# Altium schematic sheet Sheet_1_2021-06-29.schdoc
size 249 x 187 mm
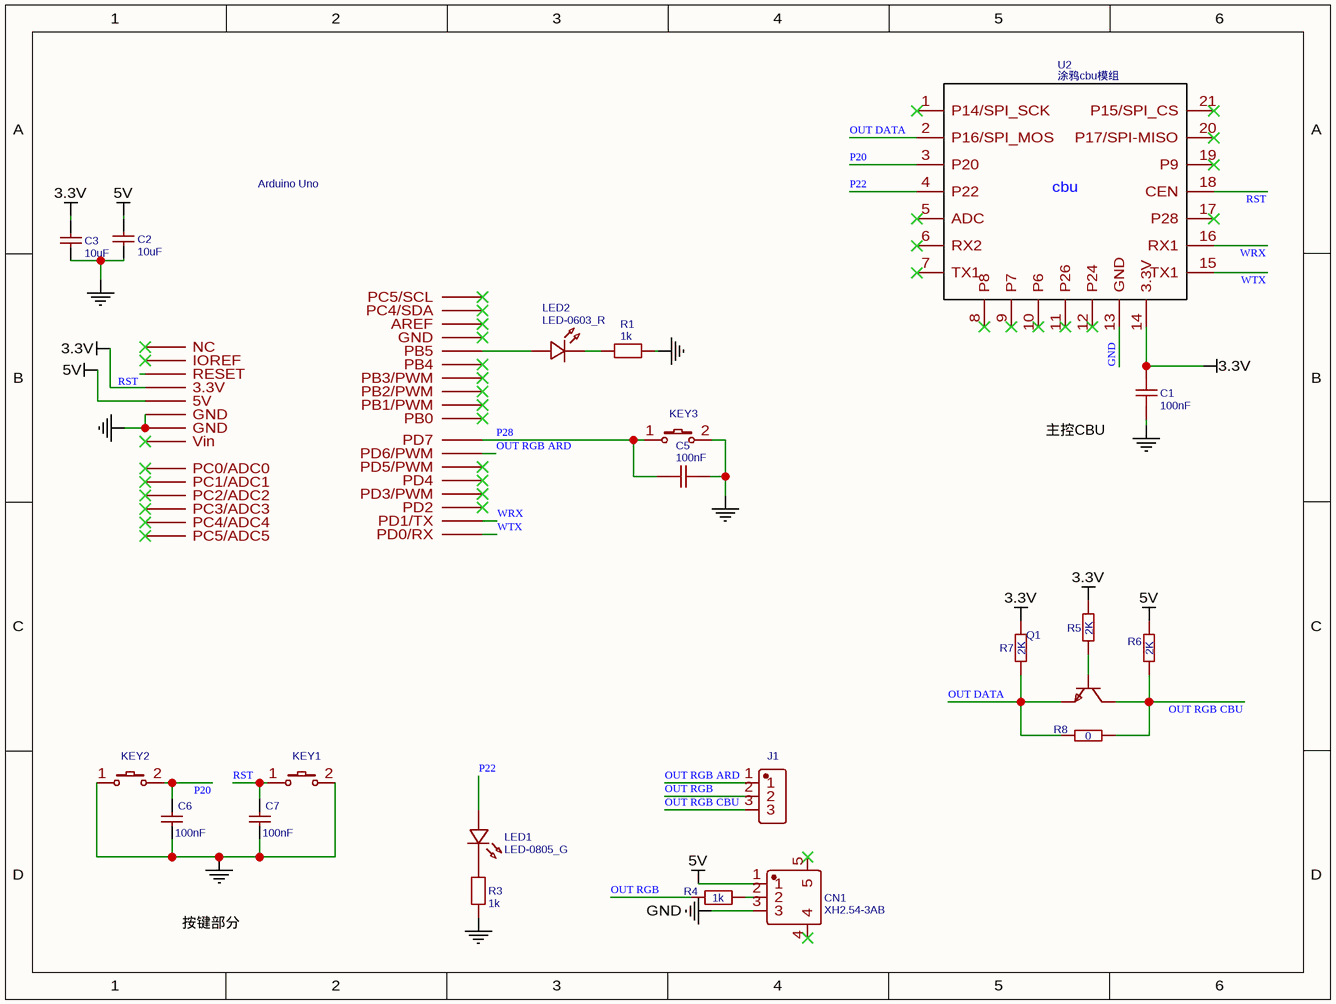
[diagram p0: Sheet_1_2021-06-29.schdoc]

## Parts
A1  Arduino Uno  [ARDUINO UNO_P2]
C1  100nF  [C0805]
C2  10uF  [C0805]
C3  10uF  [C0805]
C5  100nF  [C0805]
C6  100nF  [C0805]
C7  100nF  [C0805]
CN1  XH2.54-3AB  [CONN-SMD_3P-P2.54_XH2.54-3AB]
J1  A2541WV-3P  [HDR-TH_3P-P2.54-V-M]  (value not drawn)
KEY1  K2-3.6×6.1_SMD  [KEY-SMD_2P-L6.2-W3.6-LS8.0]  (value not drawn)
KEY2  K2-3.6×6.1_SMD  [KEY-SMD_2P-L6.2-W3.6-LS8.0]  (value not drawn)
KEY3  K2-3.6×6.1_SMD  [KEY-SMD_2P-L6.2-W3.6-LS8.0]  (value not drawn)
LED1  LED-0805_G  [LED0805_GREEN]
LED2  LED-0603_R  [LED0603_RED]
Q1  S8050_C908252  [SOT-23-3_L2.9-W1.3-P1.90-LS2.4-BR]  (value not drawn)
R1  1k  [R0805]
R3  1k  [R0805]
R4  1k  [R0805]
R5  2K  [R0805]
R6  2K  [R0805]
R7  2K  [R0805]
R8  0  [R0805]
U2  涂鸦cbu模组  [WIFI_BLE_CBU]

## Nets
3.3V: A1.4(3.3V) C1.1 C3.1 R5.2 R7.2 U2.14(3.3V)
5V: A1.5(5V) C2.1 CN1.1 R6.2
GND: A1.6(GND) A1.7(GND) C1.2 C2.2 C3.2 C5.1 C6.1 C7.1 CN1.3 KEY1.2 KEY2.1 KEY3.2 R1.2 R3.2 U2.13(GND)
OUT DATA: Q1.2(E) R7.1 R8.1 U2.2(P16/SPI_MOS)
OUT RGB: J1.2 R4.1
OUT RGB ARD: A1.21(PD6/PWM) J1.1
OUT RGB CBU: J1.3 Q1.3(C) R6.1 R8.2
P20: C6.2 KEY2.2 U2.3(P20)
P22: LED1.1 U2.4(P22)
P28: A1.22(PD7) C5.2 KEY3.1
RST: A1.3(RESET) C7.2 KEY1.1 U2.18(CEN)
WRX: A1.16(PD1/TX) U2.16(RX1)
WTX: A1.15(PD0/RX) U2.15(TX1)
NetA1_28: A1.28(PB5) LED2.1
NetCN1_2: CN1.2 R4.2
NetLED1_2: LED1.2 R3.1
NetLED2_2: LED2.2 R1.1
NetQ1_1: Q1.1(B) R5.1

Not connected (* = marked no-connect by the designer): A1 1(NC)* 2(IOREF)* 8(Vin)* 9(PC0/ADC0)* 10(PC1/ADC1)* 11(PC2/ADC2)* 12(PC3/ADC3)* 13(PC4/ADC4)* 14(PC5/ADC5)* 17(PD2)* 18(PD3/PWM)* 19(PD4)* 20(PD5/PWM)* 23(PB0)* 24(PB1/PWM)* 25(PB2/PWM)* 26(PB3/PWM)* 27(PB4)* 29(GND)* 30(AREF)* 31(PC4/SDA)* 32(PC5/SCL)*; CN1 4* 5*; U2 1(P14/SPI_SCK)* 5(ADC)* 6(RX2)* 7(TX1)* 8(P8)* 9(P7)* 10(P6)* 11(P26)* 12(P24)* 17(P28)* 19(P9)* 20(P17/SPI-MISO)* 21(P15/SPI_CS)*

## Notes on the sheet
- 主控CBU
- 按键部分
- (in symbol 涂鸦cbu模组) cbu

## Library data of the parts
A1 = Arduino Uno: Contributor: keleeda; BOM_Manufacturer Part: Arduino Uno; spicePre: A; spiceSymbolName: Arduino Uno
C1 C5 = 100nF: BOM_Manufacturer: MuRata; BOM_Manufacturer Part: GRM21BR61C106KE15L; nameAlias: Capacitance; BOM_Supplier: LCSC; BOM_Supplier Part: C77075; spicePre: C; spiceSymbolName: GRM21BR61C106KE15L
C2 C3 = 10uF: BOM_Manufacturer Part: CC0805KRX7R9BB104; BOM_Manufacturer: YAGEO; nameAlias: Capacitance; SMT Type: Basic; BOM_Supplier: LCSC; BOM_LCSC Assembly: Yes; BOM_Supplier Part: C49678; spicePre: C; spiceSymbolName: CC0805KRX7R9BB104
C6 C7 = 100nF: BOM_Manufacturer Part: CC0805KRX7R9BB104; BOM_Manufacturer: YAGEO; nameAlias: Capacitance; SMT Type: Basic; BOM_Supplier: LCSC; BOM_LCSC Assembly: Yes; BOM_Supplier Part: C49678; spicePre: C; spiceSymbolName: CC0805KRX7R9BB104
CN1 = XH2.54-3AB: BOM_Manufacturer: Boom Precision Elec; Contributor: LCSC; BOM_Supplier: LCSC; BOM_Supplier Part: C146126; BOM_Manufacturer Part: -; BOM_JLCPCB Part Class: Extended Part; spicePre: C; spiceSymbolName: XH2.54-3AB
J1 = A2541WV-3P: BOM_Manufacturer: Changjiang Connectors; Contributor: LCSC; BOM_Supplier: LCSC; BOM_Supplier Part: C225478; BOM_Manufacturer Part: A2541WV-3P; BOM_JLCPCB Part Class: Extended Part; spicePre: H; spiceSymbolName: A2541WV-3P
KEY1-KEY3 = K2-3.6×6.1_SMD: BOM_Manufacturer Part: K2-1107ST-A4SW-06; Contributor: LCEDA_Lib; 制造商: 韩国韩荣; BOM_Supplier Part: C118141; BOM_Supplier: LCSC; spicePre: K; spiceSymbolName: K2-3.6×6.1_SMD
LED1 = LED-0805_G: BOM_Manufacturer: 国星光电; BOM_Manufacturer Part: NCD0805G1; Contributor: LCEDA_Lib; BOM_Supplier Part: C84260; spicePre: L; spiceSymbolName: LED-0805_G
LED2 = LED-0603_R: BOM_Manufacturer: EVERLIGHT(台湾亿光); BOM_Manufacturer Part: 19-217/R6C-AL1M2VY/3T; Contributor: LCEDA_01; BOM_Supplier Part: C72044; BOM_Supplier: LCSC; spicePre: L; spiceSymbolName: LED-0603_R
Q1 = S8050_C908252: BOM_Manufacturer: FUXINSEMI; BOM_Manufacturer Part: S8050; Contributor: LCSC; BOM_Supplier: LCSC; BOM_Supplier Part: C908252; BOM_JLCPCB Part Class: Extended Part; spicePre: Q; spiceSymbolName: S8050_C908252
R1 R3 R4 = 1k: nameAlias: Value(Ω); Contributor: LCEDA_Lib; spicePre: R; spiceSymbolName: R_0805_EU
R5-R7 = 2K: BOM_Manufacturer: Tyohm; BOM_Manufacturer Part: RMC08052K5%N; nameAlias: Resistance (Ohms); Contributor: LCSC; BOM_Paste Type: Extended Part; BOM_Supplier: LCSC; BOM_Supplier Part: C269731; BOM_JLCPCB Part Class: Extended Part; JLCPCB Part Class: Extended Part; spicePre: R; spiceSymbolName: RMC08052K5%N
R8 = 0: BOM_Manufacturer: TA-I Tech; BOM_Manufacturer Part: RM10FTN0; nameAlias: Resistance (Ohms); Contributor: LCSC; BOM_Supplier: LCSC; BOM_Supplier Part: C254574; BOM_JLCPCB Part Class: Extended Part; spicePre: R; spiceSymbolName: RM10FTN0
U2 = 涂鸦cbu模组: BOM_Manufacturer: 涂鸦智能; Contributor: 鱼人永不为奴; BOM_Supplier: 涂鸦智能; BOM_Supplier Part: CBU 模组; link: https://developer.tuya.com/cn/docs/iot/cbu-module?id=Ka8uv3u1q1xxc; spicePre: U; spiceSymbolName: 涂鸦cbu模组